# EAGLE design SPv1 (EAGLE 6.5.0)

## Sheet 1 of 4
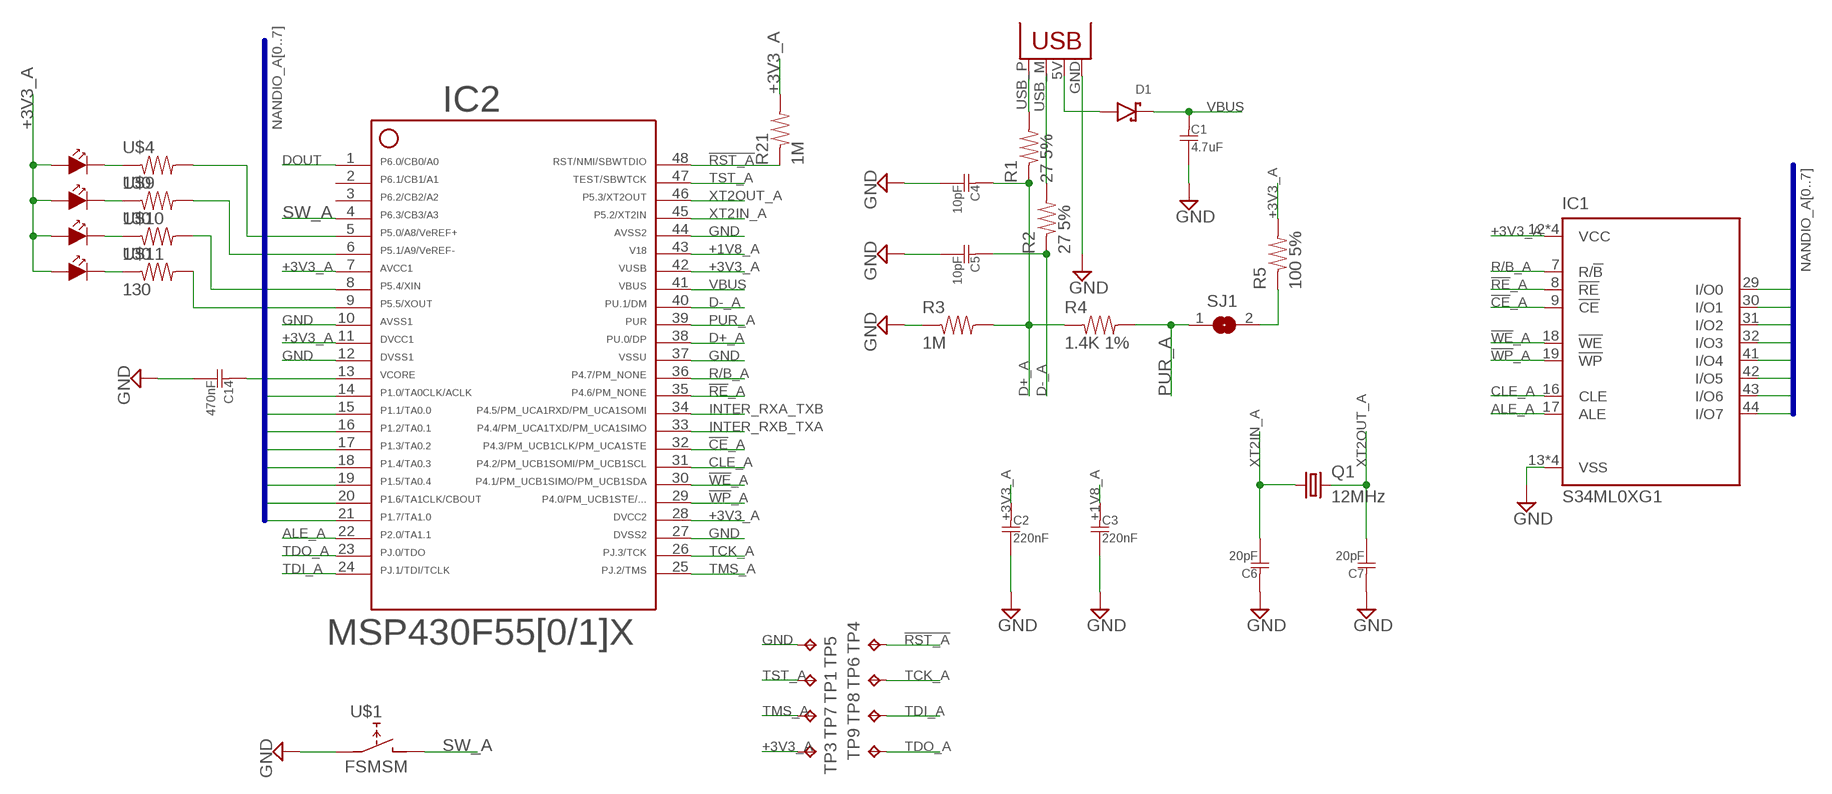
[diagram p0: schematic, sheet 1]

### Parts
C1  4.7uF  C0805  [R0805]
C2  220nF  C0805  [R0805]
C3  220nF  C0805  [R0805]
C4  10pF  C0805  [R0805]
C5  10pF  C0805  [R0805]
C6  20pF  C0805  [R0805]
C7  20pF  C0805  [R0805]
C14  470nF  C0805  [R0805]
D1  D-SCHOTTKY  [SOD123]
IC1  S34ML0XG1  [TSOP48]
IC2  F55[0/1]X---PT48  [PT48]
JP1  USBPCB  [USB-A-PCB]
Q1  12MHz  CRYSTALCSM-3X  [CSM-3X]
R1  27 5%  R0805  [R0805]
R2  27 5%  R0805  [R0805]
R3  1M  R0805  [R0805]
R4  1.4K 1%  R0805  [R0805]
R5  100 5%  R0805  [R0805]
R21  1M  R0805  [R0805]
SJ1  SJW  [SJW]
TP1  TPTP08SQ  [TP08SQ]
TP3  TPTP08SQ  [TP08SQ]
TP4  TPTP08SQ  [TP08SQ]
TP5  TPTP08SQ  [TP08SQ]
TP6  TPTP08SQ  [TP08SQ]
TP7  TPTP08SQ  [TP08SQ]
TP8  TPTP08SQ  [TP08SQ]
TP9  TPTP08SQ  [TP08SQ]
U$1  FSMSM  [FSMSM]
U$4  130  R0805  [R0805]
U$5  LED  [LED0805]
U$6  LED  [LED0805]
U$7  LED  [LED0805]
U$8  LED  [LED0805]
U$9  130  R0805  [R0805]
U$10  130  R0805  [R0805]
U$11  130  R0805  [R0805]

### Nets
!CE!_A: IC1.9(!CE) IC2.32
!RE!_A: IC1.8(!RE) IC2.35
!RST_A!: IC2.48 R21.P$1 TP4.TP
!WE!_A: IC1.18(!WE) IC2.30
!WP!_A: IC1.19(!WP) IC2.29
+1V8_A: C3.P$1 IC2.43
+3V3_A: C2.P$1 IC1.12(VCC) IC1.34(VCC) IC1.37(VCC) IC1.39(VCC) IC2.7 IC2.11 IC2.28 IC2.42 R5.P$2 R21.P$2 TP3.TP U$5.ANODE U$6.ANODE U$7.ANODE U$8.ANODE
ALE_A: IC1.17(ALE) IC2.22
CLE_A: IC1.16(CLE) IC2.31
D+_A: C4.P$1 IC2.38 R1.P$1 R3.P$2 R4.P$1
D-_A: C5.P$1 IC2.40 R2.P$1
DOUT: IC2.1 ; also sheet 2
GND: C1.P$2 C2.P$2 C3.P$2 C4.P$2 C5.P$2 C6.P$1 C7.P$1 C14.P$2 IC1.13(VSS) IC1.25(VSS) IC1.36(VSS) IC1.48(VSS) IC2.10 IC2.12 IC2.27 IC2.37 IC2.44 JP1.GND R3.P$1 TP5.TP U$1.P$1(A1) ; also sheet 2,3,4
INTER_RXA_TXB: IC2.34 ; also sheet 3
INTER_RXB_TXA: IC2.33 ; also sheet 3
N$1: JP1.USB_P(D+) R1.P$2
N$2: JP1.USB_M(D-) R2.P$2
N$3: C14.P$1 IC2.13
N$4: R5.P$1 SJ1.2
N$19: IC2.9 U$11.P$2
N$22: U$7.CATHODE U$10.P$1
N$23: U$6.CATHODE U$9.P$1
N$24: U$4.P$1 U$5.CATHODE
N$25: U$8.CATHODE U$11.P$1
N$26: IC2.8 U$10.P$2
N$27: IC2.6 U$9.P$2
N$28: IC2.5 U$4.P$2
N$33: D1.ANODE JP1.5V(VBUS)
NANDIO_A0: IC1.29(I/O0) IC2.14
NANDIO_A1: IC1.30(I/O1) IC2.15
NANDIO_A2: IC1.31(I/O2) IC2.16
NANDIO_A3: IC1.32(I/O3) IC2.17
NANDIO_A4: IC1.41(I/O4) IC2.18
NANDIO_A5: IC1.42(I/O5) IC2.19
NANDIO_A6: IC1.43(I/O6) IC2.20
NANDIO_A7: IC1.44(I/O7) IC2.21
PUR_A: IC2.39 R4.P$2 SJ1.1
R/B_A: IC1.7(R/!B) IC2.36
SW_A: IC2.4 U$1.P$2(B)
TCK_A: IC2.26 TP6.TP
TDI_A: IC2.24 TP8.TP
TDO_A: IC2.23 TP9.TP
TMS_A: IC2.25 TP7.TP
TST_A: IC2.47 TP1.TP
VBUS: C1.P$1 D1.CATHODE IC2.41 ; also sheet 2,3,4
XT2IN_A: C6.P$2 IC2.45 Q1.P$1
XT2OUT_A: C7.P$2 IC2.46 Q1.P$2
Unconnected: IC2.2 IC2.3

### Buses
NANDIO_A[0..7]

## Sheet 2 of 4
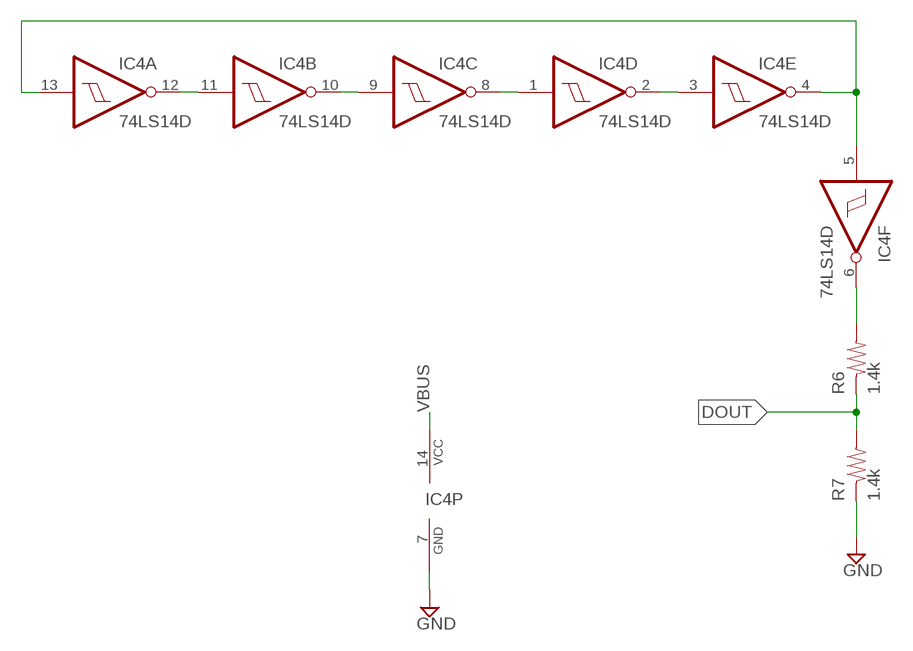
[diagram p1: schematic, sheet 2]

### Parts
IC4  74LS14D  [SO14]
R6  1.4k  R0805  [R0805]
R7  1.4k  R0805  [R0805]

### Nets
DOUT: R6.P$1 R7.P$2 ; also sheet 1
GND: IC4.7(P:GND) R7.P$1 ; also sheet 1,3,4
N$5: IC4.11(B:I) IC4.12(A:O)
N$6: IC4.9(C:I) IC4.10(B:O)
N$7: IC4.1(D:I) IC4.8(C:O)
N$8: IC4.2(D:O) IC4.3(E:I)
N$9: IC4.4(E:O) IC4.5(F:I) IC4.13(A:I)
N$10: IC4.6(F:O) R6.P$2
VBUS: IC4.14(P:VCC) ; also sheet 1,3,4

## Sheet 3 of 4
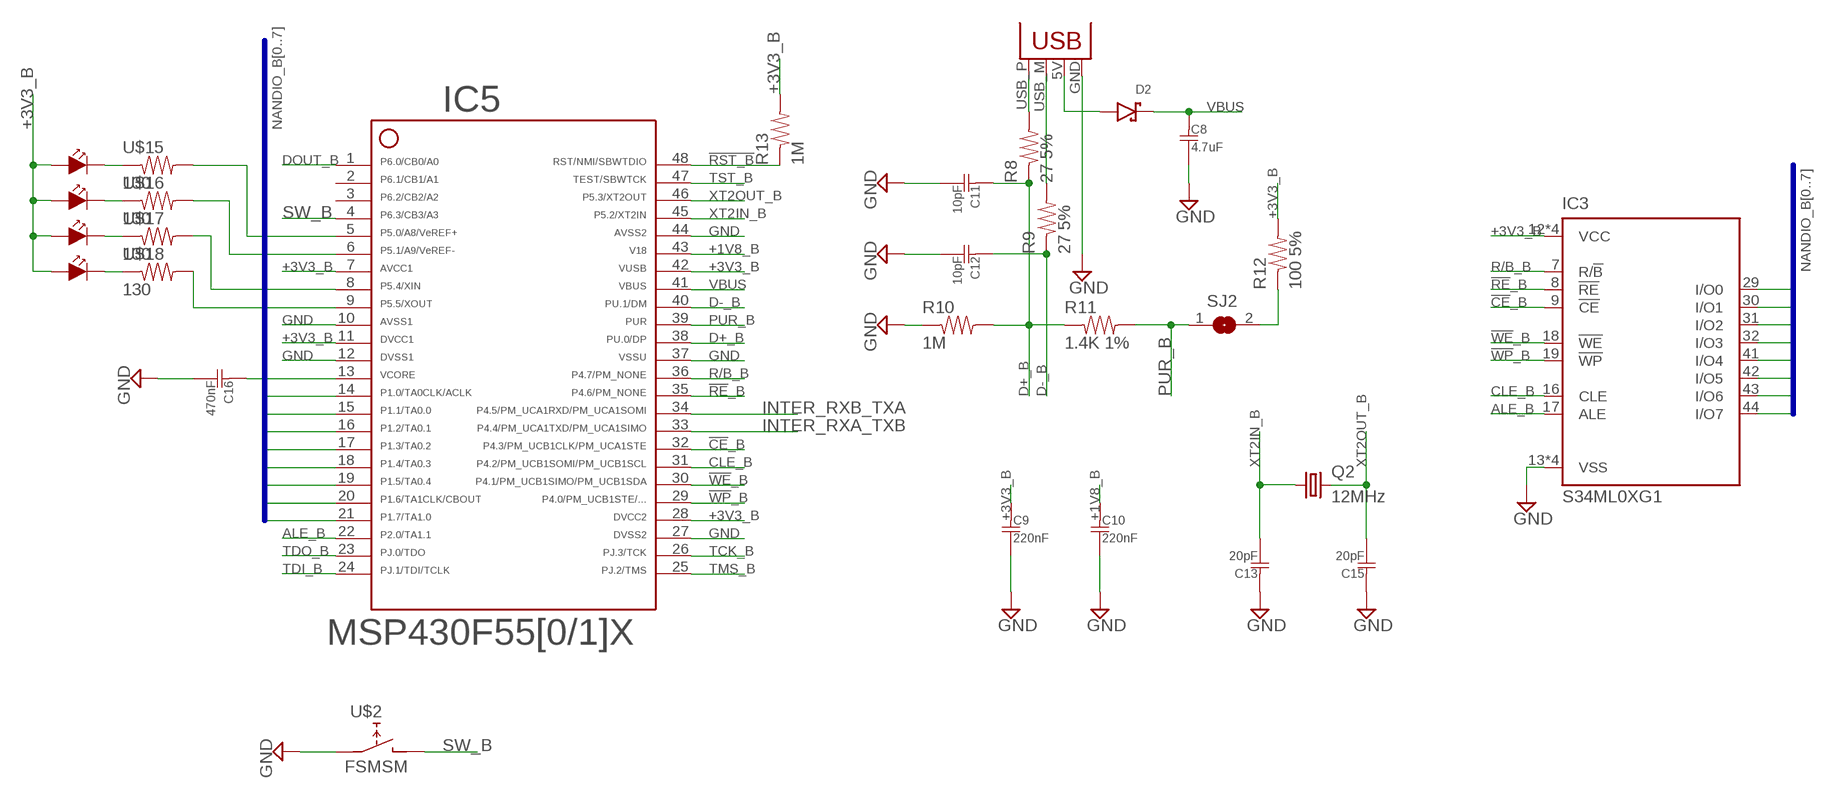
[diagram p2: schematic, sheet 3]

### Parts
C8  4.7uF  C0805  [R0805]
C9  220nF  C0805  [R0805]
C10  220nF  C0805  [R0805]
C11  10pF  C0805  [R0805]
C12  10pF  C0805  [R0805]
C13  20pF  C0805  [R0805]
C15  20pF  C0805  [R0805]
C16  470nF  C0805  [R0805]
D2  D-SCHOTTKY  [SOD123]
IC3  S34ML0XG1  [TSOP48]
IC5  F55[0/1]X---PT48  [PT48]
JP2  USBPCB  [USB-A-PCB]
Q2  12MHz  CRYSTALCSM-3X  [CSM-3X]
R8  27 5%  R0805  [R0805]
R9  27 5%  R0805  [R0805]
R10  1M  R0805  [R0805]
R11  1.4K 1%  R0805  [R0805]
R12  100 5%  R0805  [R0805]
R13  1M  R0805  [R0805]
SJ2  SJW  [SJW]
U$2  FSMSM  [FSMSM]
U$3  LED  [LED0805]
U$12  LED  [LED0805]
U$13  LED  [LED0805]
U$14  LED  [LED0805]
U$15  130  R0805  [R0805]
U$16  130  R0805  [R0805]
U$17  130  R0805  [R0805]
U$18  130  R0805  [R0805]

### Nets
!CE!_B: IC3.9(!CE) IC5.32
!RE!_B: IC3.8(!RE) IC5.35
!RST_B!: IC5.48 R13.P$1
!WE!_B: IC3.18(!WE) IC5.30
!WP!_B: IC3.19(!WP) IC5.29
+1V8_B: C10.P$1 IC5.43
+3V3_B: C9.P$1 IC3.12(VCC) IC3.34(VCC) IC3.37(VCC) IC3.39(VCC) IC5.7 IC5.11 IC5.28 IC5.42 R12.P$2 R13.P$2 U$3.ANODE U$12.ANODE U$13.ANODE U$14.ANODE
ALE_B: IC3.17(ALE) IC5.22
CLE_B: IC3.16(CLE) IC5.31
D+_B: C11.P$1 IC5.38 R8.P$1 R10.P$2 R11.P$1
D-_B: C12.P$1 IC5.40 R9.P$1
DOUT_B: IC5.1 ; also sheet 4
GND: C8.P$2 C9.P$2 C10.P$2 C11.P$2 C12.P$2 C13.P$1 C15.P$1 C16.P$2 IC3.13(VSS) IC3.25(VSS) IC3.36(VSS) IC3.48(VSS) IC5.10 IC5.12 IC5.27 IC5.37 IC5.44 JP2.GND R10.P$1 U$2.P$1(A1) ; also sheet 1,2,4
INTER_RXA_TXB: IC5.33 ; also sheet 1
INTER_RXB_TXA: IC5.34 ; also sheet 1
N$12: JP2.USB_P(D+) R8.P$2
N$13: JP2.USB_M(D-) R9.P$2
N$14: C16.P$1 IC5.13
N$15: U$13.CATHODE U$17.P$1
N$16: U$12.CATHODE U$16.P$1
N$17: U$3.CATHODE U$15.P$1
N$18: U$14.CATHODE U$18.P$1
N$20: IC5.9 U$18.P$2
N$21: IC5.8 U$17.P$2
N$29: IC5.6 U$16.P$2
N$30: IC5.5 U$15.P$2
N$31: R12.P$1 SJ2.2
N$40: D2.ANODE JP2.5V(VBUS)
NANDIO_A8: IC3.29(I/O0) IC5.14
NANDIO_A9: IC3.30(I/O1) IC5.15
NANDIO_A10: IC3.31(I/O2) IC5.16
NANDIO_A11: IC3.32(I/O3) IC5.17
NANDIO_A12: IC3.41(I/O4) IC5.18
NANDIO_A13: IC3.42(I/O5) IC5.19
NANDIO_A14: IC3.43(I/O6) IC5.20
NANDIO_A15: IC3.44(I/O7) IC5.21
PUR_B: IC5.39 R11.P$2 SJ2.1
R/B_B: IC3.7(R/!B) IC5.36
SW_B: IC5.4 U$2.P$2(B)
TCK_B: IC5.26
TDI_B: IC5.24
TDO_B: IC5.23
TMS_B: IC5.25
TST_B: IC5.47
VBUS: C8.P$1 D2.CATHODE IC5.41 ; also sheet 1,2,4
XT2IN_B: C13.P$2 IC5.45 Q2.P$1
XT2OUT_B: C15.P$2 IC5.46 Q2.P$2
Unconnected: IC5.2 IC5.3

### Buses
NANDIO_B[0..7]

## Sheet 4 of 4
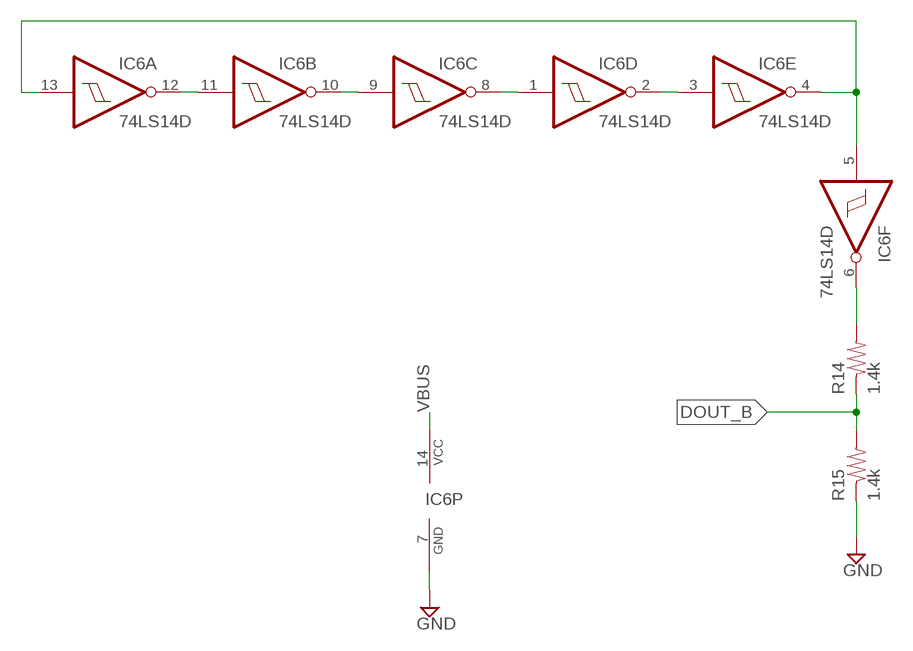
[diagram p3: schematic, sheet 4]

### Parts
IC6  74LS14D  [SO14]
R14  1.4k  R0805  [R0805]
R15  1.4k  R0805  [R0805]

### Nets
DOUT_B: R14.P$1 R15.P$2 ; also sheet 3
GND: IC6.7(P:GND) R15.P$1 ; also sheet 1,2,3
N$34: IC6.11(B:I) IC6.12(A:O)
N$35: IC6.9(C:I) IC6.10(B:O)
N$36: IC6.1(D:I) IC6.8(C:O)
N$37: IC6.2(D:O) IC6.3(E:I)
N$38: IC6.4(E:O) IC6.5(F:I) IC6.13(A:I)
N$39: IC6.6(F:O) R14.P$2
VBUS: IC6.14(P:VCC) ; also sheet 1,2,3

## Library data of the parts
C1-C16 = Passives:C
D1 D2 = Passives:D-SCHOTTKY
IC1 IC3 = Flash:S34ML0XG1: Spansion 1GB, 2GB, and 4GB x8 NAND Flash Memory In x8 I/O mode
IC2 IC5 = TI_MSP430_v16:F55[0/1]X---PT48: ***F55[0/1/2]X*** PT48 Rev. 1.0 06/2010 "http://www.ti.com/lit/gpn/msp430f5509" Only for FF5504, F5508,F5509,F5510
IC4 IC6 = 74xx-us:74*14: Hex schmitt trigger INVERTER
JP1 JP2 = SparkFun-Connectors:USB: USB Connectors USB-B-PTH is fully proven SKU : PRT-00139/CONN-08278 USB-miniB is fully proven SKU : PRT-00587 USB-A-PCB is untested. USB-A-H is throughly reviewed, but untested. Spark Fun Electronics SKU : PRT-00437 USB-B-SMT is throughly reviewed, but untested. Needs silkscreen touching up. USB-A-S has not been used/tested USB-MB-H has not been used/tested USB-MICROB has been used. CONN-09505
Q1 Q2 = Passives:CRYSTAL: CRYSTAL
R1-R15 R21 U$4 U$9-U$11 U$15-U$18 = Passives:R: A standard resistor.
SJ1 SJ2 = jumper:SJ: SMD solder JUMPER
TP1 TP3-TP9 = testpad:TP: Test pad
U$1 U$2 = Passives:FSMSM
U$3 U$5-U$8 U$12-U$14 = Passives:LED

## Board
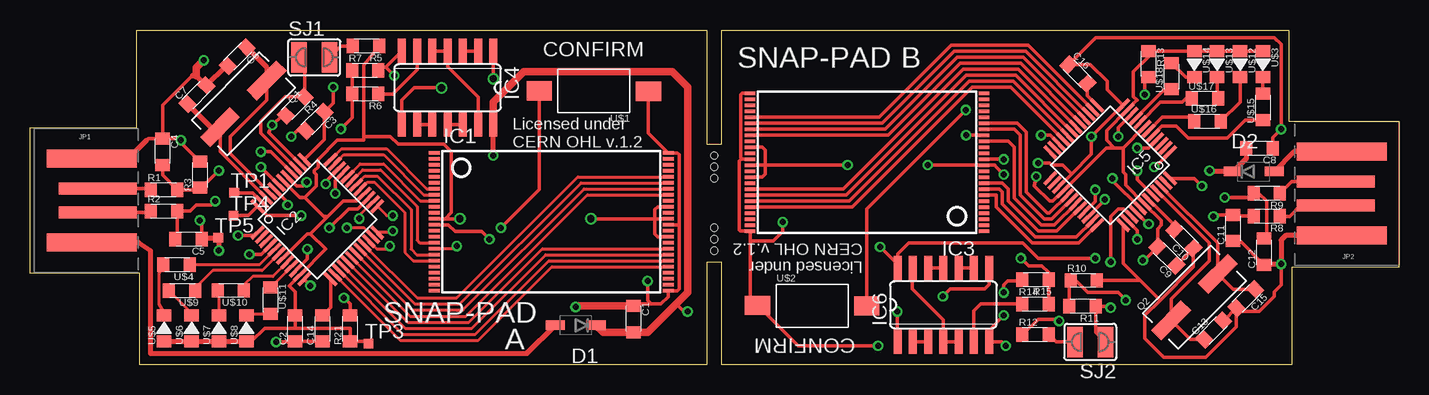
[diagram p4: board, top side]
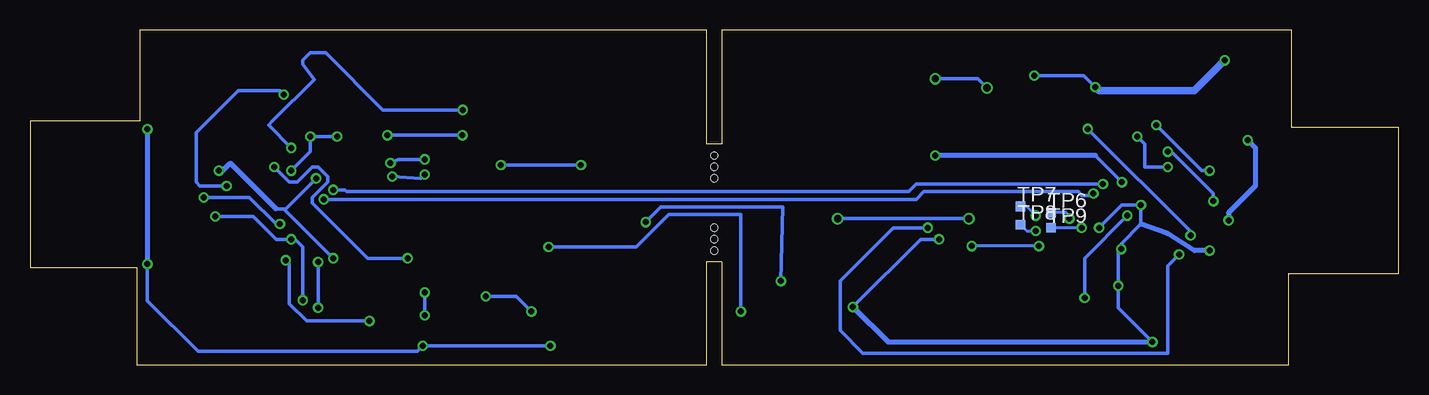
[diagram p5: board, bottom side, seen from below]

Size 114.05 x 27.94 mm. Coordinates in mm from the lower left corner, seen from the top.
Outline: 8.89,19.81 8.89,27.94 56.39,27.94 56.39,18.41 57.66,18.41 57.66,27.94 104.9,27.94 104.9,20.32 114.05,20.32 114.05,8.13 105.16,8.13 105.16,0 57.66,0 57.66,8.57 56.39,8.57 56.39,0 9.14,0 9.14,7.62 0,7.62 0,19.81 8.89,19.81
Copper layers (1*16): Top 0.0356mm / dielectric 1.5011mm / Bottom 0.0356mm
Design rules "LaenPCBOrder": minimum track width 6mil, minimum drill 13mil, track to track 6mil, track to pad 6mil, pad to pad 6mil, via to via 6mil, smd to smd 6mil, copper to edge 15mil, drill to drill 6mil, minimum pad ring 7mil, minimum via ring 7mil, stop-mask expansion 3mil, vias tented up to drill 0mil, thermal gap 10mil
Holes 0.6 mm at 57.02,17.46 57.02,16.51 57.02,15.56 57.02,11.43 57.02,10.48 57.02,9.53

### Footprints (pad centres in the part's own frame; a part is rotated, then mirrored left to right if it is on the bottom)
R0805 = smd 1 x 1.2: P$1 1.1,0; P$2 -1.1,0
SOD123 = smd 1.6 x 0.8: ANODE 1.7,0; CATHODE -1.7,0
TSOP48 = smd 0.9 x 0.3: 1 -9.75,5.75; 2 -9.75,5.25; 3 -9.75,4.75; 4 -9.75,4.25; 5 -9.75,3.75; 6 -9.75,3.25; 7 -9.75,2.75; 8 -9.75,2.25; 9 -9.75,1.75; 10 -9.75,1.25; 11 -9.75,0.75; 12 -9.75,0.25; 13 -9.75,-0.25; 14 -9.75,-0.75; 15 -9.75,-1.25; 16 -9.75,-1.75; 17 -9.75,-2.25; 18 -9.75,-2.75; 19 -9.75,-3.25; 20 -9.75,-3.75; 21 -9.75,-4.25; 22 -9.75,-4.75; 23 -9.75,-5.25; 24 -9.75,-5.75; 25 9.75,-5.75; 26 9.75,-5.25; 27 9.75,-4.75; 28 9.75,-4.25; 29 9.75,-3.75; 30 9.75,-3.25; 31 9.75,-2.75; 32 9.75,-2.25; 33 9.75,-1.75; 34 9.75,-1.25; 35 9.75,-0.75; 36 9.75,-0.25; 37 9.75,0.25; 38 9.75,0.75; 39 9.75,1.25; 40 9.75,1.75; 41 9.75,2.25; 42 9.75,2.75; 43 9.75,3.25; 44 9.75,3.75; 45 9.75,4.25; 46 9.75,4.75; 47 9.75,5.25; 48 9.75,5.75
PT48 = smd 1.4 x 0.3: 1 -4.3,2.75; 2 -4.3,2.25; 3 -4.3,1.75; 4 -4.3,1.25; 5 -4.3,0.75; 6 -4.3,0.25; 7 -4.3,-0.25; 8 -4.3,-0.75; 9 -4.3,-1.25; 10 -4.3,-1.75; 11 -4.3,-2.25; 12 -4.3,-2.75; 25 4.3,-2.75; 26 4.3,-2.25; 27 4.3,-1.75; 28 4.3,-1.25; 29 4.3,-0.75; 30 4.3,-0.25; 31 4.3,0.25; 32 4.3,0.75; 33 4.3,1.25; 34 4.3,1.75; 35 4.3,2.25; 36 4.3,2.75 | smd 0.3 x 1.4: 13 -2.75,-4.3; 14 -2.25,-4.3; 15 -1.75,-4.3; 16 -1.25,-4.3; 17 -0.75,-4.3; 18 -0.25,-4.3; 19 0.25,-4.3; 20 0.75,-4.3; 21 1.25,-4.3; 22 1.75,-4.3; 23 2.25,-4.3; 24 2.75,-4.3; 37 2.75,4.3; 38 2.25,4.3; 39 1.75,4.3; 40 1.25,4.3; 41 0.75,4.3; 42 0.25,4.3; 43 -0.25,4.3; 44 -0.75,4.3; 45 -1.25,4.3; 46 -1.75,4.3; 47 -2.25,4.3; 48 -2.75,4.3
SO14 = smd 0.66 x 2.032: 1 -3.81,-3.073; 2 -2.54,-3.073; 3 -1.27,-3.073; 4 0,-3.073; 5 1.27,-3.073; 6 2.54,-3.073; 7 3.81,-3.073; 8 3.81,3.073; 9 2.54,3.073; 10 1.27,3.073; 11 0,3.073; 12 -1.27,3.073; 13 -2.54,3.073; 14 -3.81,3.073
USB-A-PCB = smd 7.5 x 1.5: 5V -0.2,-3.5; GND -0.2,3.5 | smd 6.5 x 1: USB_M 0.3,-1; USB_P 0.3,1
CSM-3X = smd 3.5 x 1.2: P$1 -2.75,0; P$2 2.75,0
SJW = smd 1.27 x 2.54: 1 -1.27,0; 2 1.27,0
TP08SQ = smd 0.8 x 0.8: TP 0,0
FSMSM = smd 2.1 x 1.6: P$1 -4.55,0.05; P$2 4.55,0
LED0805 = smd 1 x 1.2: ANODE -1.1,0; CATHODE 1.1,0

### Placement (x,y rotation side)
C1  50.29,3.81 270 top
C2  22.1,3.05 90 top
C3  23.75,20.32 225 top
C4  11.05,17.78 270 top
C5  13.21,10.48 180 top
C6  17.27,25.72 225 top
C7  13.91,22.54 45 top
C8  102.46,18.08 180 top
C9  94.74,9.07 135 top
C10  96.16,10.51 135 top
C11  100.26,11.42 90 top
C12  102.82,9.44 90 top
C13  98.63,2.91 45 top
C14  24.38,3.05 90 top
C15  101.31,5.52 225 top
C16  87.32,24.26 315 top
D1  45.47,3.3 180 top
D2  101.98,16.14 0 top
IC1  43.43,11.94 0 top
IC2  23.95,12.14 45 top
IC3  69.76,16.9 180 top
IC4  34.8,23.11 180 top
IC5  90.01,16.65 225 top
IC6  76.11,5.01 0 top
JP1  5.33,13.72 0 top
JP2  109.09,14.29 180 top
Q1  17.78,21.78 225 top
Q2  97.04,5.66 45 top
R1  11.18,14.6 0 top
R2  11.18,12.83 0 top
R3  14.16,15.88 90 top
R4  22.1,21.59 225 top
R5  28,26.61 180 top
R6  27.94,22.61 180 top
R7  27.94,24.57 0 top
R8  103.06,12.4 180 top
R9  103.06,14.31 180 top
R10  87.82,7.04 0 top
R11  87.71,4.88 180 top
R12  83.78,2.54 0 top
R13  93.22,25.08 270 top
R14  83.78,5.08 0 top
R15  83.78,7.12 180 top
R21  26.67,3.05 90 top
SJ1  23.69,25.65 0 top
SJ2  88.36,1.91 180 top
TP1  17.02,14.35 0 top
TP3  28.19,1.78 0 top
TP4  16.95,12.45 0 top
TP5  15.68,10.6 0 top
TP6  28.96,12.7 0 bottom
TP7  31.5,13.21 0 bottom
TP8  31.5,11.68 0 bottom
TP9  28.96,11.43 0 bottom
U$1  46.99,22.86 180 top
U$2  65.18,4.92 0 top
U$3  102.74,25.08 270 top
U$4  12.22,8.35 180 top
U$5  11.18,3.05 90 top
U$6  13.46,3.05 90 top
U$7  15.75,3.05 90 top
U$8  18.03,3.05 90 top
U$9  12.66,6.2 180 top
U$10  16.73,6.21 180 top
U$11  20.04,5.36 270 top
U$12  100.84,25.08 270 top
U$13  98.93,25.08 270 top
U$14  97.03,25.08 270 top
U$15  102.74,21.52 90 top
U$16  98.13,20.32 0 top
U$17  97.91,22.23 0 top
U$18  95.12,24.08 90 top

### Tracks (layer width: path | path; a pad name or v marks a point on that pad's centre or on a via)
!CE!_A
  Top 0.254: IC2.32 27.52,16.76 29.46,16.76 32.54,13.69 IC1.9
!CE!_B
  Top 0.305: IC3.9 81.01,15.15 81.51,14.65 81.51,13.65 84.01,11.15 85.57,11.15 IC5.32
!RE!_A
  Top 0.254: IC2.35 26.16,17.53 29.46,17.53 32.8,14.19 IC1.8
!RE!_B
  Top 0.305: IC3.8 80.76,14.65 81.01,14.4 81.01,13.4 83.76,10.65 87.19,10.65 IC5.35
!RST_A!  (via drill 0.5)
  Top 0.305: R21.P$1 26.67,5.08 v26.16,5.59 | TP4.TP 18.03,12.45 18.18,12.45 IC2.48 19.75,12.45 v22.61,12.45
  Bottom 0.305: v26.16,5.59 26.16,8.89 v22.61,12.45
!RST_B!  (via drill 0.5)
  Top 0.305: IC5.48 97.03,15.55 v97.66,14.92 | v92.9,22.54 92.9,23.66 R13.P$1
  Bottom 0.305: v97.66,14.92 99.88,14.92 100.2,15.24 100.2,19.37 96.71,22.86 93.22,22.86 v92.9,22.54
!WE!_A
  Top 0.254: IC2.30 27.92,15.75 28.96,15.75 31.75,12.95 31.75,9.65 32.21,9.19 IC1.18
!WE!_B
  Top 0.305: IC3.18 82.01,19.65 82.51,19.15 82.51,14.15 84.51,12.15 85.15,12.15 IC5.30
!WP!_A
  Top 0.254: IC2.29 28.11,15.24 28.7,15.24 31.24,12.7 31.24,9.4 31.95,8.69 IC1.19
!WP!_B
  Top 0.305: IC3.19 82.26,20.15 83.01,19.4 83.01,14.4 84.76,12.65 84.95,12.65 IC5.29
+1V8_A  (via drill 0.5)
  Top 0.305: IC2.43 19.24,16.49 v19.24,16.51 | v21.78,19.05 22.27,19.54 C3.P$1
  Bottom 0.305: v19.24,16.51 21.14,16.51 21.14,18.41 v21.78,19.05
+1V8_B
  Top 0.305: C10.P$1 95.38,11.63 IC5.43
+3V3_A  (via drill 0.6)
  Top 0.305: IC1.39 52.3,13.19 52.07,12.95 52.07,12.19 | IC1.34 52.3,10.69 52.07,10.92 52.07,12.19 | IC1.37 52.07,12.19 | 52.07,12.19 | 52.07,12.19 v46.74,12.19 | v35.81,12.19 IC1.12 34.6,12.19 35.12,12.7 35.12,17.78 34.48,18.41 30.67,18.41 30.04,19.05 27.81,19.05 | 22.1,3.05 26.67,3.05 R21.P$2 28.02,1.95 TP3.TP | 22.1,3.05 C2.P$1 22.1,6.1 21.59,6.6 21.6,6.6 IC2.11 22.5,7.52 24.64,9.65 23.37,10.92 | U$8.ANODE 18.46,1.95 19.56,3.05 22.1,3.05 | 23.37,10.92 23.09,10.92 IC2.7 | IC2.42 22.46,13.97 22.9,13.97 | IC2.28 27.23,13.65 26.23,13.65 26.1,13.65 24.83,12.38 | R5.P$2 27.81,25 27.81,19.05 | 27.81,19.05 27.81,18.73 25.59,18.73 24,17.15 24,16.51 23.68,16.19 23.68,16.03 23.84,15.88 23.84,14.92 22.9,13.97 | 23.37,10.92 24.83,12.38 | 22.9,13.97 24.49,12.38 24.83,12.38
  Top 0.406: U$5.ANODE U$6.ANODE U$7.ANODE U$8.ANODE
  Bottom 0.305: v46.74,12.19 36.32,12.19 | 36.32,12.19 v35.81,12.19 36.32,12.19
+3V3_B  (via drill 0.5)
  Top 0.305: IC3.34 61.01,18.15 61.26,17.9 61.26,16.65 | 61.26,16.65 61.26,15.9 61.01,15.65 IC3.39 | IC3.37 61.26,16.65 | 90.36,18.1 89.73,18.73 89.73,19.55 IC5.11 92.24,22.07 92.27,22.07 91.95,22.38 91.95,24.45 93.22,25.72 R13.P$2 U$14.ANODE U$13.ANODE U$12.ANODE U$3.ANODE | 90.36,18.1 91.1,18.1 | 91.1,18.1 IC5.7 | 91.1,18.1 91.1,16.09 91.31,15.88 91.31,14.99 IC5.42 94.26,12.05 94.26,11.65 93.96,11.35 C9.P$1 92.84,8.73 v92.74,8.73 | 90.36,18.1 89.69,18.1 IC5.28 85.24,13.65 84.96,13.65 83.69,14.92 v83.85,15.72 | v81.15,15.88 80.52,16.51 80.38,16.65 IC3.12 74.82,16.65 v74.8,16.67 | v68.13,16.67 61.28,16.67 61.26,16.65 | R12.P$2 82.74,2.54 84.01,3.81 85.6,3.81 v85.76,3.65
  Bottom 0.305: v83.85,15.72 81.47,15.56 v81.15,15.88 | v74.8,16.67 v68.13,16.67 | v85.76,3.65 90.99,3.65 92.42,5.08 92.42,8.41 v92.74,8.73
ALE_A  (via drill 0.5)
  Top 0.254: IC2.22 28.91,9.65 29.72,9.65 v29.97,9.91 | v35.56,9.91 35.34,9.69 IC1.17
  Bottom 0.254: v29.97,9.91 v35.56,9.91
ALE_B  (via drill 0.5)
  Top 0.305: IC3.17 v78.01,19.15 | v84.26,19.15 85.03,19.15 IC5.22
  Bottom 0.305: v78.01,19.15 v84.26,19.15
CLE_A
  Top 0.254: IC2.31 27.72,16.26 29.21,16.26 32.26,13.21 32.26,10.41 32.48,10.19 IC1.16
CLE_B
  Top 0.305: IC3.16 81.51,18.65 82.01,18.15 82.01,13.9 84.26,11.65 85.36,11.65 IC5.31
D+_A  (via drill 0.5)
  Top 0.305: C4.P$1 11.05,15.83 R1.P$1 13.99,14.6 R3.P$2 14.33,14.78 v15.75,16.19 | IC2.38 19.9,19.37 v20.19,20 21,20.81 R4.P$1
  Bottom 0.305: v15.75,16.19 16.38,16.19 v20.19,20
D+_B  (via drill 0.5)
  Top 0.305: R11.P$1 86.61,6.94 R10.P$2 87.13,7.04 88.14,6.03 90.68,6.03 v91.31,5.4 | R8.P$1 100.38,12.4 C11.P$1 98.76,12.52 v98.62,12.38 | v92.27,10.48 92.27,11.21 IC5.38
  Bottom 0.305: v98.62,12.38 95.44,12.38 93.54,10.48 v92.27,10.48 | v92.27,10.48 91.95,10.48 | 91.95,10.48 91.31,9.84 v91.31,5.4 | 91.95,10.48 v92.27,10.48
D-_A  (via drill 0.5)
  Top 0.305: C5.P$1 12.28,10.65 R2.P$1 13.34,12.83 13.84,13.33 15.11,13.33 v15.43,13.65 | v19.24,17.78 20.07,17.78 IC2.40
  Bottom 0.305: v15.43,13.65 15.43,14.29 18.92,17.78 v19.24,17.78
D-_B  (via drill 0.5)
  Top 0.305: C12.P$1 103.06,10.77 103.06,13.65 102.41,14.31 R9.P$1 101.62,13.97 v99.57,13.97 | v93.22,11.75 93.14,11.75 IC5.40
  Bottom 0.305: v99.57,13.97 95.76,13.97 93.54,11.75 v93.22,11.75
DOUT  (via drill 0.5)
  Top 0.305: R7.P$2 R6.P$1 26.84,20.62 v25.91,19.69 | v17.34,10.79 18.72,10.79 IC2.1
  Bottom 0.305: v25.91,19.69 17.34,11.11 v17.34,10.79
DOUT_B  (via drill 0.5)
  Top 0.305: R14.P$1 R15.P$2 84.88,7.7 84.33,8.26 83.22,8.26 v82.58,8.89 | IC5.1 93.76,16.51 v93.69,16.51
  Bottom 0.305: v93.69,16.51 92.42,15.24 91.79,15.24 90.52,16.51 90.04,16.51 89.25,15.72 89.25,15.24 90.52,13.97 90.52,13.49 85.91,8.89 v82.58,8.89
GND  (via drill 0.5)
  Top 0.305: 51.78,5.08 52.58,5.08 53.18,5.69 IC1.25 53.94,6.19 54.1,6.35 54.1,11.68 | 51.78,5.08 50.46,5.08 C1.P$2 | 54.1,11.68 54.1,17.53 53.94,17.69 IC1.48 51.54,19.33 U$1.P$1 | IC1.36 54.1,11.69 54.1,11.68 | R7.P$1 29.69,24.89 | 29.69,24.89 IC4.7 | C14.P$2 C2.P$2 22.05,1.91 v20.51,1.91 | IC2.12 22.85,7.12 v23.37,6.6 | v23.11,9.65 23.11,8.82 IC2.10 | v21.46,13.33 21.46,13.56 IC2.44 | v24.96,11.43 26.54,13.02 27.31,13.02 IC2.27 | IC2.37 24.53,18.79 C3.P$2 25.27,21.84 v25.27,23.18 | v30.35,24.13 29.69,24.79 29.69,24.89 | IC1.13 34.86,11.69 35.43,11.11 37.66,11.11 v38.29,10.48 | C9.P$2 96.94,9.71 C10.P$2 96.94,8.16 94.17,5.4 | IC5.12 89.76,22.98 89.76,23.65 88.37,25.04 C16.P$2 88.81,27.3 103.7,27.3 104.26,26.74 v104.26,19.65 103.56,18.95 103.56,18.45 | IC5.12 90.99,21.63 | 94.17,5.4 92.9,4.13 92.9,2.22 93.85,1.27 94.49,0.64 97.98,0.64 100.53,3.19 C15.P$1 | C13.P$1 99.47,3.69 C15.P$1 | C15.P$1 100.83,4.45 102.43,4.45 103.7,5.71 103.7,6.11 104.26,6.67 v104.26,8.4 | R10.P$1 92.52,7.04 92.58,6.99 | 92.58,6.99 94.17,5.4 | IC5.37 91.1,8.46 92.58,6.99 | v81.15,4.13 79.92,2.9 IC6.7 80.96,1.94 v81.31,1.59 | v81.15,6.03 81.15,6.67 81.47,6.99 82.55,6.99 R15.P$1 | IC3.13 v81.15,17.15 | 60.01,10.16 60.01,5.59 U$2.P$1 64.01,1.59 v70.68,1.59 | 60.01,10.16 IC3.48 59.21,11.15 59.09,11.27 | IC5.44 92.27,15.45 v92.27,16.19 | v90.68,19.05 90.68,19.8 IC5.10 | IC5.12 91.04,21.63 v88.46,19.05 88.46,17.57 86.81,15.93 | 86.81,15.93 IC5.27 | v84.01,16.83 84.96,16.83 85.12,16.67 86.07,16.67 86.81,15.93 | IC3.36 59.4,17.15 59.33,17.22 | 59.33,17.22 59.25,17.3 59.25,22.54 59.35,22.65 IC3.25 | 59.09,11.27 59.09,16.99 59.33,17.22
  Top 0.305: 59.09,11.27 59.09,12.38 | v51.47,6.99 51.47,5.4 51.78,5.08 | v62.74,11.91 62.74,11.11 61.94,10.32 60.17,10.32 60.01,10.16 | 9.71,18.73 9.86,18.88 C4.P$2 | C4.P$2 11.05,21.65 13.53,24.13 | C4.P$2 12.43,18.88 v12.57,18.73 12.57,18.56 R3.P$1 | 14.31,11.92 C5.P$2 14.43,10.6 14.5,10.6 | 8.2,17.22 JP1.GND | C11.P$2 100.84,10.32 C12.P$2
  Top 0.406: C6.P$1 16.3,24.94 C7.P$1 13.88,24.13 13.53,24.13 | 8.2,17.22 9.71,18.73 | 14.5,10.6 TP5.TP 15.75,10.54 v15.75,9.53 | v14.16,12.06 14.31,11.92 | C8.P$2 103.56,18.45 | JP2.GND 104.64,10.79 104.26,10.4 v104.26,8.4 102.89,8.4 C12.P$2
  Top 0.61: C1.P$2 45.55,4.91 v45.47,4.83 | v14.48,25.4 13.88,24.8 13.88,24.13
  Bottom 0.305: v24.96,11.43 24.64,11.75 23.05,13.33 v21.46,13.33 21.46,11.75 23.11,10.1 v23.11,9.65 23.37,9.4 v23.37,6.6 23.37,4.76 v20.51,1.91 | v25.27,23.18 26.23,24.13 v30.35,24.13 | v38.29,10.48 39.81,10.48 v45.47,4.83 | v81.15,4.13 v81.15,6.03 | v81.15,17.15 83.38,17.15 v84.01,16.83 | v70.68,1.59 v81.31,1.59 81.79,1.11 100.04,1.11 104.26,5.33 v104.26,8.4 | v92.27,16.19 90.68,17.78 v90.68,19.05 v88.46,19.05 | v51.47,6.99 51.31,13.18 55.44,13.18 55.75,13.18 61.47,13.18 v62.74,11.91
  Bottom 0.406: v15.75,9.53 17.02,9.53 19.24,10.95 21.46,11.75 | v12.57,18.73 11.94,18.1 11.94,14.92 14.16,12.7 v14.16,12.06 | v45.47,4.83 42.55,1.91 v20.51,1.91 | v104.26,19.65 v104.26,8.4
  Bottom 0.61: v25.27,23.18 24.96,22.86 17.02,22.86 v14.48,25.4
INTER_RXA_TXB  (via drill 0.5)
  Top 0.305: IC2.34 24.64,15.3 v24.64,15.08 | IC5.33 88.77,13.65 v88.77,14.6
  Bottom 0.305: v24.64,15.08 25.75,15.08 | 25.75,15.08 25.91,15.08 | v88.77,14.6 87.82,14.6 87.66,14.45 55.75,14.45 40.83,14.45 40.2,15.08 25.75,15.08
INTER_RXB_TXA  (via drill 0.5)
  Top 0.305: IC2.33 25.43,15.38 v25.43,14.29 | IC5.34 89.57,13.73 v89.57,13.81
  Bottom 0.305: v25.43,14.29 25.59,14.13 26.38,14.13 26.7,14.45 39.56,14.45 40.2,13.81 87.34,13.81 v89.57,13.81
N$1
  Top 0.305: JP1.USB_P 9.96,14.72 R1.P$2
N$2
  Top 0.305: JP1.USB_M 9.96,12.72 R2.P$2
N$3
  Top 0.305: IC2.13 25.05,4.81 C14.P$1
N$4
  Top 0.305: SJ1.2 25.91,26.61 R5.P$1
N$5
  Top 0.305: IC4.11 IC4.12
N$6
  Top 0.305: IC4.9 IC4.10
N$7  (via drill 0.6)
  Top 0.305: IC4.1 v38.61,23.88 | v34.29,23.11 32,23.11 31.24,22.35 30.99,22.1 IC4.8
  Bottom 0.305: v38.61,23.88 35.05,23.88 v34.29,23.11
N$8
  Top 0.305: IC4.3 IC4.2
N$9
  Top 0.305: IC4.5 IC4.4 34.8,24.89 35.56,24.13 37.34,22.35 IC4.13
N$10
  Top 0.305: IC4.6 32.26,24.64 30.23,22.61 R6.P$2
N$12
  Top 0.305: JP2.USB_P 105.87,13.29 104.96,12.38 104.18,12.38 R8.P$2
N$13
  Top 0.305: JP2.USB_M 105.14,15.29 R9.P$2
N$14
  Top 0.305: C16.P$1 88.1,22.45 IC5.13
N$15
  Top 0.305: U$13.CATHODE 98.93,22.3 U$17.P$1
N$16
  Top 0.305: U$12.CATHODE 100.84,21.93 U$16.P$1
N$17
  Top 0.305: U$3.CATHODE U$15.P$1
N$18
  Top 0.305: U$14.CATHODE 96.32,23.98 U$18.P$1
N$19
  Top 0.254: IC2.9 U$11.P$2
N$20
  Top 0.305: U$18.P$2 94.57,22.98 IC5.9
N$21
  Top 0.305: U$17.P$2 96.33,22.23 96.01,21.9 94.2,21.9 IC5.8
N$22
  Top 0.254: U$10.P$1 15.75,6.1 U$7.CATHODE
N$23
  Top 0.254: U$9.P$1 13.46,4.3 U$6.CATHODE
N$24
  Top 0.254: U$4.P$1 10.73,7.64 10.73,5.08 11.18,4.32 U$5.CATHODE
N$25
  Top 0.254: U$8.CATHODE 18.15,4.27 U$11.P$1
N$26
  Top 0.254: IC2.8 20.24,7.37 18.54,7.37 17.83,6.66 U$10.P$2
N$27
  Top 0.254: IC2.6 19.34,7.87 15.24,7.87 13.57,6.2 U$9.P$2
N$28
  Top 0.254: IC2.5 19.11,8.35 U$4.P$2
N$29
  Top 0.305: U$16.P$2 97.03,20.63 97.01,20.65 94.36,20.65 IC5.6
N$30
  Top 0.305: U$15.P$2 101.28,20.42 99.76,18.9 96.51,18.9 95.51,19.9 94.32,19.9 IC5.5
N$31
  Top 0.305: SJ2.2 85.52,1.91 R12.P$1
N$33
  Top 0.406: JP1.5V 9.02,10.22 10.03,9.53 10.03,1.27 10.03,0.95 41.42,0.95 D1.ANODE
N$34
  Top 0.305: IC6.12 IC6.11
N$35
  Top 0.305: IC6.10 IC6.9
N$36  (via drill 0.5)
  Top 0.305: IC6.8 79.92,6.71 79.57,6.35 76.71,6.35 v76.07,5.71 | v72.26,4.45 72.26,1.98 IC6.1
  Bottom 0.305: v76.07,5.71 73.53,5.71 v72.26,4.45
N$37
  Top 0.305: IC6.2 IC6.3
N$38
  Top 0.305: IC6.5 IC6.4 76.11,3.77 73.53,6.35 73.53,8.05 IC6.13
N$39
  Top 0.305: IC6.6 78.65,4.49 79.25,5.08 R14.P$2
N$40
  Top 0.406: JP2.5V 105.33,17.79 D2.ANODE
NANDIO_A0
  Top 0.254: IC2.14 30.87,2.03 37.34,2.03 43.49,8.19 IC1.29
NANDIO_A1
  Top 0.254: IC2.15 31.07,2.54 37.08,2.54 43.23,8.69 IC1.30
NANDIO_A2
  Top 0.254: IC2.16 31.27,3.05 36.83,3.05 42.97,9.19 IC1.31
NANDIO_A3
  Top 0.254: IC2.17 31.47,3.56 36.58,3.56 42.71,9.69 IC1.32
NANDIO_A4
  Top 0.254: IC2.18 31.67,4.06 36.32,4.06 46.45,14.19 IC1.41
NANDIO_A5
  Top 0.254: IC2.19 31.87,4.57 36.07,4.57 46.18,14.69 IC1.42
NANDIO_A6
  Top 0.254: IC2.20 32.07,5.08 35.81,5.08 45.92,15.19 IC1.43
NANDIO_A7
  Top 0.254: IC2.21 32.27,5.59 35.56,5.59 45.66,15.69 IC1.44
NANDIO_A8
  Top 0.305: IC3.29 70.76,20.65 76.76,26.65 83.19,26.65 IC5.14
NANDIO_A9
  Top 0.305: IC3.30 71.01,20.15 77.01,26.15 82.98,26.15 IC5.15
NANDIO_A10
  Top 0.305: IC3.31 71.26,19.65 77.26,25.65 82.78,25.65 IC5.16
NANDIO_A11
  Top 0.305: IC3.32 71.51,19.15 77.51,25.15 82.57,25.15 IC5.17
NANDIO_A12
  Top 0.305: IC3.41 67.76,14.65 77.76,24.65 82.36,24.65 IC5.18
NANDIO_A13
  Top 0.305: IC3.42 68.01,14.15 78.01,24.15 82.15,24.15 IC5.19
NANDIO_A14
  Top 0.305: IC3.43 68.26,13.65 78.26,23.65 81.95,23.65 IC5.20
NANDIO_A15
  Top 0.305: IC3.44 68.51,13.15 78.51,23.15 81.74,23.15 IC5.21
PUR_A
  Top 0.305: SJ1.1 22.88,25.19 R4.P$2 21.29,22.37 19.24,20.32 19.24,19.32 IC2.39
PUR_B  (via drill 0.5)
  Top 0.305: SJ2.1 88.81,2.73 R11.P$2 89.92,4.88 v90.04,4.76 | IC5.39 91.17,13.02 90.68,13.02 90.04,12.38 v90.04,8.57
  Bottom 0.305: v90.04,8.57 v90.04,4.76
R/B_A
  Top 0.254: IC2.36 25.96,18.03 29.72,18.03 33.06,14.69 IC1.7
R/B_B
  Top 0.305: IC3.7 80.51,14.15 80.51,13.15 83.51,10.15 87.4,10.15 IC5.36
SW_A  (via drill 0.5)
  Top 0.305: IC2.4 19.25,9.21 v18.29,9.21 | v39.24,11.43 42.44,14.63 U$1.P$2
  Bottom 0.305: v18.29,9.21 19.24,8.26 19.24,0.95 44.64,0.95 46.55,2.86 46.55,6.99 42.1,11.43 v39.24,11.43
SW_B  (via drill 0.5)
  Top 0.305: U$2.P$2 69.73,13.02 v77.98,21.27 | v92.27,18.1 93.22,18.1 IC5.4
  Bottom 0.305: v77.98,21.27 84.65,21.27 89.41,26.03 90.68,26.03 91.31,25.4 91.31,25.08 90.36,23.81 93.85,20.32 94.17,20 v92.27,18.1
TCK_A  (via drill 0.5)
  Top 0.254: IC2.26 27.44,12.45 v27.43,12.19
  Bottom 0.254: v27.43,12.19 27.69,12.7 TP6.TP
TDI_A  (via drill 0.5)
  Top 0.254: v30.23,11.18 30.09,11.04 IC2.24
  Bottom 0.254: TP8.TP 30.99,11.18 v30.23,11.18
TDO_A  (via drill 0.5)
  Top 0.254: IC2.23 27.84,11.43 v26.42,11.43
  Bottom 0.254: v26.42,11.43 TP9.TP
TMS_A  (via drill 0.5)
  Top 0.254: IC2.25 29.72,12.45 v30.23,12.45
  Bottom 0.254: v30.23,12.45 30.99,13.21 TP7.TP
TST_A
  Top 0.305: TP1.TP 18.55,14.35 IC2.47
VBUS  (via drill 0.5)
  Top 0.305: IC2.41 22.22,14.92 22.73,14.92 v23.05,15.24 | 51.62,2.86 51.48,2.71 | v88.77,8.89 84.01,8.89 82.74,10.16 73.21,10.16 72.3,9.25 IC6.14 72.3,8.37 v70.83,9.84 | IC5.41 90.2,15.4 v90.2,15.56 | v54.8,4.45 54.48,4.45 53.85,5.08
  Top 0.406: v38.61,17.46 IC4.14 | C8.P$1 101.36,17.22 D2.CATHODE 98.35,16.14 v98.3,16.19
  Top 0.61: D1.CATHODE 47.76,2.71 C1.P$1 51.48,2.71 53.85,5.08 54.8,6.03 54.8,23.18 53.53,24.45 41.15,24.45 38.61,21.91 IC4.14
  Bottom 0.305: v23.05,15.24 25.27,17.46 | v88.77,8.89 92.9,13.02 93.38,13.02 | 93.38,13.02 93.54,13.02 | v90.2,15.56 92.74,13.02 93.38,13.02 | v70.83,9.84 63.53,9.84 60.83,12.54 54.8,12.54 v54.8,4.45
  Bottom 0.406: 25.27,17.46 v38.61,17.46 | v98.3,16.19 97.98,16.19 97.35,16.83 93.54,13.02
XT2IN_A
  Top 0.305: Q1.P$1 19.72,22.07 16.7,19.05 16.7,17.62 IC2.45
  Top 0.406: C6.P$2 19.72,24.82 Q1.P$1
XT2IN_B
  Top 0.305: Q2.P$1 95.09,5.48 98.26,8.65 98.26,10.17 IC5.45 | Q2.P$1 95.09,3.62 | C13.P$2 96.67,2.13 Q2.P$1
XT2OUT_A
  Top 0.305: Q1.P$2 15.84,17.78 IC2.46
  Top 0.406: C7.P$2 15.06,19.84 Q1.P$2
XT2OUT_B
  Top 0.305: IC5.46 98.98,10.15 Q2.P$2 100.28,6.3 C15.P$2

### Text on the board
tNames: CONFIRM | SNAP-PAD | B | Licensed under / CERN OHL v.1.2 | Licensed under / CERN OHL v.1.2 | SNAP-PAD | CONFIRM | A